# Altium project PCB_Project.PrjPcb
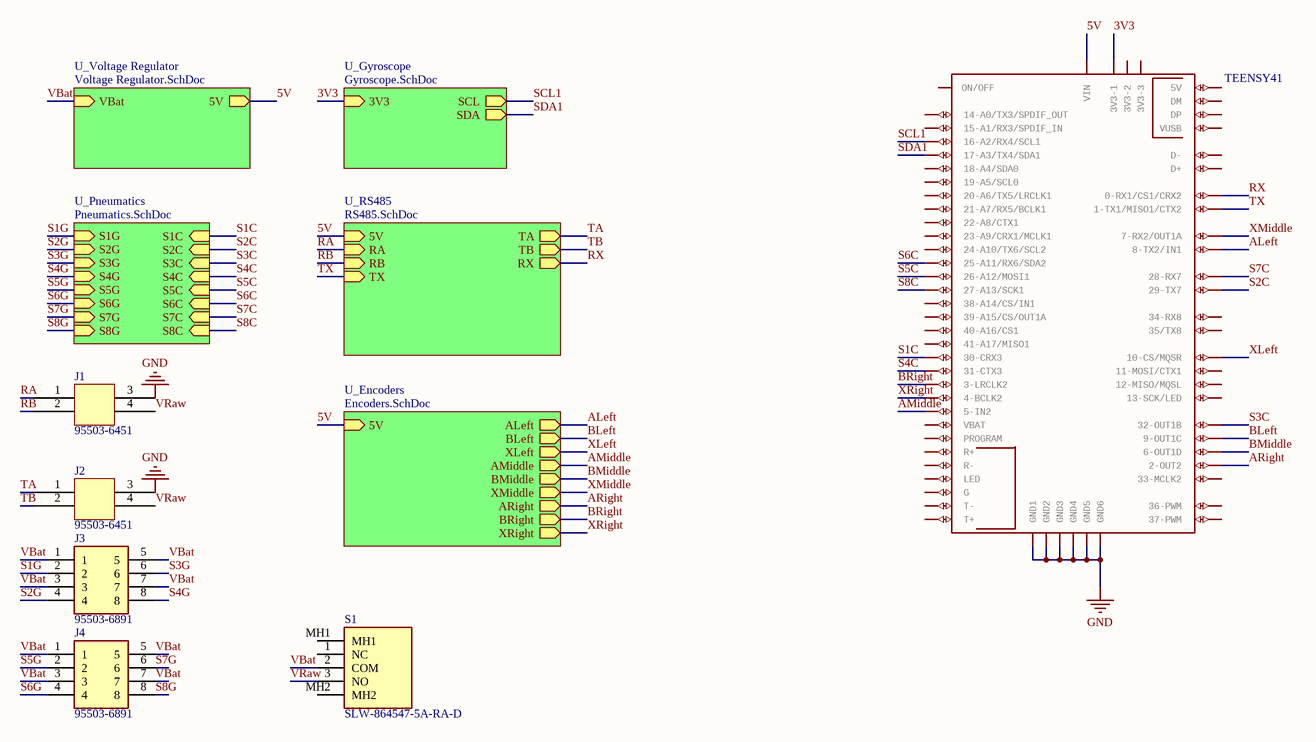
[diagram p0: Top Level.SchDoc]
2 sheets, 9 parts. Net scope: hierarchical (ports join the sheet entries above them; power ports are global).
Board file: JBrain.PcbDoc
Sheets:
  Top Level.SchDoc
    U_Voltage Regulator = Voltage Regulator.SchDoc

## Sheet Top Level.SchDoc: Top Level
size A4; Engineer: Jason Zhou; Organization: JANK; DocumentNumber: 1; Revision: 1; SheetNumber: 1; SheetTotal: 6; Projectidentifier: V5 Co-processor

### Parts
J1  95503-6451  [95503-6451-Footprint-1]
J2  95503-6451  [95503-6451-Footprint-1]
J3  95503-6891  [95503-6891]
J4  95503-6891  [95503-6891]
S1  SLW-864547-5A-RA-D  [SLW8645475ARAD]
U1  TEENSY41  [TEENSY41]

### Sub-sheets
U_Encoders = Encoders.SchDoc (file not in this document): BLeft (out), ALeft (out), XLeft (out), BMiddle (out), AMiddle (out), XMiddle (out), BRight (out), ARight (out), XRight (out), 5V (in)
U_Gyroscope = Gyroscope.SchDoc (file not in this document): 3V3 (in), SCL (out), SDA (out)
U_Pneumatics = Pneumatics.SchDoc (file not in this document): S1G (in), S2G (in), S3G (in), S4G (in), S5G (in), S1C (in), S2C (in), S3C (in), S4C (in), S5C (in), S6G (in), S6C (in), S7C (in), S8G (in), S7G (in), S8C (in)
U_RS485 = RS485.SchDoc (file not in this document): TA (out), RA (in), 5V (in), RB (in), TB (out), RX (out), TX (in)
U_Voltage Regulator = Voltage Regulator.SchDoc: VBat (in), 5V (out)

### Nets
GND: J1.3 J2.3 U1.GND1 U1.GND2 U1.GND3 U1.GND4 U1.GND5 U1.GND6
3V3: U1.3V3-1 ; sheet U_Gyroscope/3V3
5V: U1.VIN ; sheet U_Voltage Regulator/5V, sheet U_RS485/5V, sheet U_Encoders/5V
ALeft: U1.8-TX2/IN1 ; sheet U_Encoders/ALeft
AMiddle: U1.5-IN2 ; sheet U_Encoders/AMiddle
ARight: U1.2-OUT2 ; sheet U_Encoders/ARight
BLeft: U1.9-OUT1C ; sheet U_Encoders/BLeft
BMiddle: U1.6-OUT1D ; sheet U_Encoders/BMiddle
BRight: U1.3-LRCLK2 ; sheet U_Encoders/BRight
RA: J1.1 ; sheet U_RS485/RA
RB: J1.2 ; sheet U_RS485/RB
RX: U1.0-RX1/CS1/CRX2 ; sheet U_RS485/RX
S1C: U1.30-CRX3 ; sheet U_Pneumatics/S1C
S1G: J3.2 ; sheet U_Pneumatics/S1G
S2C: U1.29-TX7 ; sheet U_Pneumatics/S2C
S2G: J3.4 ; sheet U_Pneumatics/S2G
S3C: U1.32-OUT1B ; sheet U_Pneumatics/S3C
S3G: J3.6 ; sheet U_Pneumatics/S3G
S4C: U1.31-CTX3 ; sheet U_Pneumatics/S4C
S4G: J3.8 ; sheet U_Pneumatics/S4G
S5C: U1.26-A12/MOSI1 ; sheet U_Pneumatics/S5C
S5G: J4.2 ; sheet U_Pneumatics/S5G
S6C: U1.25-A11/RX6/SDA2 ; sheet U_Pneumatics/S6C
S6G: J4.4 ; sheet U_Pneumatics/S6G
S7C: U1.28-RX7 ; sheet U_Pneumatics/S7C
S7G: J4.6 ; sheet U_Pneumatics/S7G
S8C: U1.27-A13/SCK1 ; sheet U_Pneumatics/S8C
S8G: J4.8 ; sheet U_Pneumatics/S8G
SCL1: U1.16-A2/RX4/SCL1 ; sheet U_Gyroscope/SCL
SDA1: U1.17-A3/TX4/SDA1 ; sheet U_Gyroscope/SDA
TA: J2.1 ; sheet U_RS485/TA
TB: J2.2 ; sheet U_RS485/TB
TX: U1.1-TX1/MISO1/CTX2 ; sheet U_RS485/TX
VBat: J3.1 J3.3 J3.5 J3.7 J4.1 J4.3 J4.5 J4.7 S1.2(COM) ; sheet U_Voltage Regulator/VBat
VRaw: J1.4 J2.4 S1.3(NO)
XLeft: U1.10-CS\MQSR(10-CS/MQSR) ; sheet U_Encoders/XLeft
XMiddle: U1.7-RX2/OUT1A ; sheet U_Encoders/XMiddle
XRight: U1.4-BCLK2 ; sheet U_Encoders/XRight

Not connected (* = marked no-connect by the designer): S1 1(NC) MH1 MH2; U1 3V3-2 3V3-3 11-MOSI/CTX1 12-MISO/MQSL 13-SCK/LED 14-A0/TX3/SPDIF_OUT 15-A1/RX3/SPDIF_IN 18-A4/SDA0 19-A5/SCL0 20-A6/TX5/LRCLK1 21-A7/RX5/BCLK1 22-A8/CTX1 23-A9/CRX1/MCLK1 24-A10/TX6/SCL2 33-MCLK2 34-RX8 35-TX8(35/TX8) 36-PWM 37-PWM 38-A14/CS/IN1 39-A15/CS/OUT1A 40-A16/CS1 41-A17/MISO1 +5V(5V) D+ D- DM DP G LED ON/OFF PROGRAM R+ R- T+ T- VBAT VUSB

### Notes on the sheet
- Size:
- Date:
- Title
- A4
- Project:
- Time:
- Revision:
- Sheet
- of
- Engineer
- File:

### Library data of the parts
J1 J2 = CMP-002-00072-2: Telecom and Datacom Connector, 4 Contact(s), Female, Straight, Surface Mount Terminal, Locking, Jack, 4p4c; RoHS Compliant: Yes; Mounting Technology: Board; Connector Type: TELECOM AND DATACOM CONNECTOR; Min Operating Temperature: -40°C; Max Operating Temperature: 85°C
J3 J4 = 95503-6891: Connector; Manufacturer_Name: Molex; Datasheet Link: https://datasheet.datasheetarchive.com/originals/distributors/Datasheets-DGA5/408567.pdf; Manufacturer_Part_Number: 95503-6891; Mouser Part Number: 538-95503-6891; Mouser Price/Stock: https://www.mouser.co.uk/ProductDetail/Molex/95503-6891?qs=MJut%252BdqOEgjIr%252BakMzdZ%252BA%3D%3D
S1 = SLW-864547-5A-RA-D: Switch; Manufacturer_Name: CUI Devices; Datasheet Link: https://www.cuidevices.com/product/resource/slw-864547-5a-ra-d.pdf; Height: 4.9mm; Manufacturer_Part_Number: SLW-864547-5A-RA-D; Mouser Part Number: 179-SLW-864547-5ARAD; Mouser Price/Stock: https://www.mouser.co.uk/ProductDetail/CUI-Devices/SLW-864547-5A-RA-D?qs=1Kr7Jg1SGW%252Bn%2FarYZIP3WQ%3D%3D; Arrow Part Number: SLW-864547-5A-RA-D; Arrow Price/Stock: https://www.arrow.com/en/products/slw-864547-5a-ra-d/cui-devices?region=nac
U1 = CMP-007-000001-4: Teensy 4.1 Development Board; Core Architecture: ARM; Evaluation Kit: Yes; GateName_1: G$1; LibraryName: teensy; Package: TEENSY41; DeviceSetName: TEENSY41; Source: teensy.SCHLIB; Series: i.MX; SymbolName_1: TEENSY41; Design Item ID: TEENSY41

## Sheet Voltage Regulator.SchDoc: Voltage Regulator
size A4; Author: Jason Zhou; Engineer: Jason Zhou; Revision: 1; SheetNumber: 2; SheetTotal: 5; Projectidentifier: V5 Coprocessor; SPICEModelCacheAZWFLMOM: <root> / <DocumentId>AZWFLMOM</DocumentId> / </root>
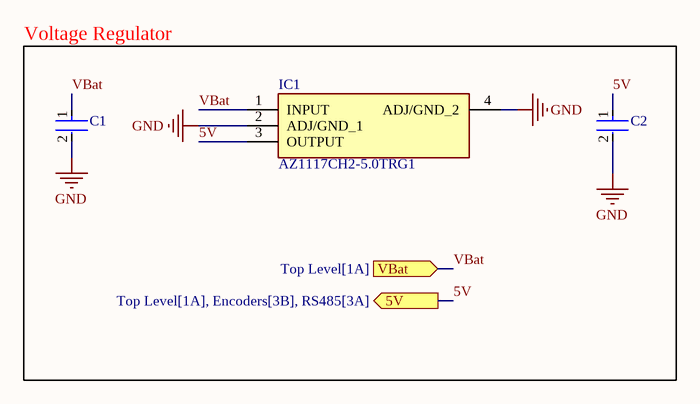
[diagram p1: Voltage Regulator.SchDoc]

### Parts
C1  CL31A106MAHNNNE  [FP-CL31-IPC_B]  (value not drawn)
C2  CL31A226MOCLNNC  [FP-CL31-IPC_A]  (value not drawn)
IC1  AZ1117CH2-5.0TRG1  [SOT230P700X180-4N]

### Blocks framed on the sheet
Voltage Regulator: C1 C2 IC1

### Ports
5V (out, see Top Level[1A], Encoders[3B], RS485[3A]), VBat (in, see Top Level[1A])

### Nets
GND: C1.2 C2.2 IC1.2(ADJ/GND_1) IC1.4(ADJ/GND_2)
5V: C2.1 IC1.3(OUTPUT) ; port 5V
VBat: C1.1 IC1.1(INPUT) ; port VBat

### Notes on the sheet
- Size:
- Date:
- Title
- A4
- Project:
- Time:
- Revision:
- Sheet
- of
- Engineer
- File:

### Library data of the parts
C1 = CMP-13271-000714-1: Cap Ceramic 10uF 25V X5R ±20% SMD 1206 +85°C Embossed T/R; Depth: 1.6mm; Length: 3.2mm; Thickness: 0.071inch; Voltage Rating: 25V; Width: 0.063inch; Mount: Surface Mount; Height: 1.6mm; Dielectric: X5R; Case Code (Metric): 3216; Case/Package: 1206; Radiation Hardening: No; Lead Free: Lead Free; Min Operating Temperature: -55°C; Tolerance: 20%; Voltage Rating (DC): 25V; Packaging: Tape and Reel; Capacitance: 10uF; Case Code (Imperial): 1206; Max Operating Temperature: 85°C
C2 = CMP-13271-002013-1: Cap Ceramic 22uF 16V X5R ±20% SMD 1206 +85°C Embossed T/R; Height: 0.85mm; Min Operating Temperature: -55°C; Thickness: 0.037inch; Depth: 1.6mm; Length: 3.2mm; Tolerance: 20%; Case Code (Imperial): 1206; Capacitance: 22uF; Package Quantity: 1; Radiation Hardening: No; Case/Package: 1206; Dielectric: X5R; Packaging: Tape and Reel; Voltage: 16V; Case Code (Metric): 3216; Width: 0.063inch; Lead Free: Lead Free; Mount: Surface Mount; Voltage Rating: 16V; Max Operating Temperature: 85°C
IC1 = AZ1117CH2-5.0TRG1: Integrated Circuit; Manufacturer_Name: Diodes Incorporated; Datasheet Link: https://www.arrow.com/en/products/az1117ch2-5.0trg1/diodes-incorporated; Height: 1.8mm; Manufacturer_Part_Number: AZ1117CH2-5.0TRG1; Mouser Part Number: 621-AZ1117CH2-5.0TRG; Mouser Price/Stock: https://www.mouser.co.uk/ProductDetail/Diodes-Incorporated/AZ1117CH2-5.0TRG1?qs=5V6w%252Be2aIqb578qtLdqPjw%3D%3D; Arrow Part Number: AZ1117CH2-5.0TRG1; Arrow Price/Stock: https://www.arrow.com/en/products/az1117ch2-5.0trg1/diodes-incorporated

## Nets that join several sheets
GND: Top Level (8 pins), Voltage Regulator (C1.2 C2.2 IC1.2 IC1.4)
5V: Top Level (U1.VIN), Voltage Regulator (C2.1 IC1.3)
VBat: Top Level (9 pins), Voltage Regulator (C1.1 IC1.1)